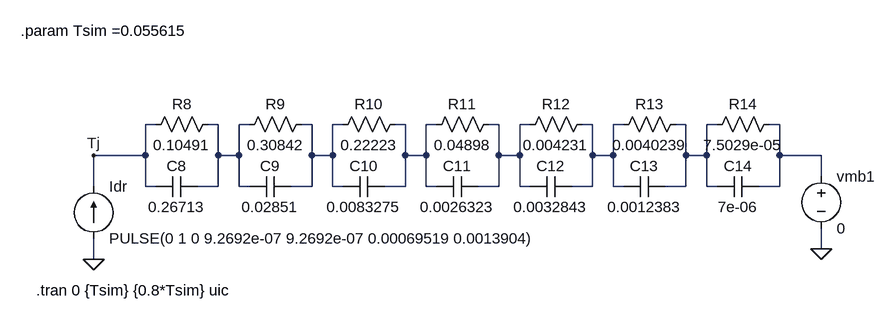
[diagram p0: schematic foster_test_matlab_pulsetrain.asc]
foster_test_matlab_pulsetrain.asc, the LTspice schematic file:
Version 4
SHEET 1 1444 1024
WIRE 0 320 -16 320
WIRE 96 320 80 320
WIRE 144 320 128 320
WIRE 240 320 224 320
WIRE 288 320 272 320
WIRE 384 320 368 320
WIRE 432 320 416 320
WIRE 528 320 512 320
WIRE 576 320 560 320
WIRE 672 320 656 320
WIRE 720 320 704 320
WIRE 816 320 800 320
WIRE 864 320 848 320
WIRE 960 320 944 320
WIRE -16 368 -16 320
WIRE -16 368 -96 368
WIRE 96 368 96 320
WIRE 128 368 128 320
WIRE 128 368 96 368
WIRE 240 368 240 320
WIRE 272 368 272 320
WIRE 272 368 240 368
WIRE 384 368 384 320
WIRE 416 368 416 320
WIRE 416 368 384 368
WIRE 528 368 528 320
WIRE 560 368 560 320
WIRE 560 368 528 368
WIRE 672 368 672 320
WIRE 704 368 704 320
WIRE 704 368 672 368
WIRE 816 368 816 320
WIRE 848 368 848 320
WIRE 848 368 816 368
WIRE 960 368 960 320
WIRE 1024 368 960 368
WIRE 1024 400 1024 368
WIRE -96 416 -96 368
WIRE -16 416 -16 368
WIRE 0 416 -16 416
WIRE 96 416 96 368
WIRE 96 416 64 416
WIRE 128 416 128 368
WIRE 144 416 128 416
WIRE 240 416 240 368
WIRE 240 416 208 416
WIRE 272 416 272 368
WIRE 288 416 272 416
WIRE 384 416 384 368
WIRE 384 416 352 416
WIRE 416 416 416 368
WIRE 432 416 416 416
WIRE 528 416 528 368
WIRE 528 416 496 416
WIRE 560 416 560 368
WIRE 576 416 560 416
WIRE 672 416 672 368
WIRE 672 416 640 416
WIRE 704 416 704 368
WIRE 720 416 704 416
WIRE 816 416 816 368
WIRE 816 416 784 416
WIRE 848 416 848 368
WIRE 864 416 848 416
WIRE 960 416 960 368
WIRE 960 416 928 416
WIRE 1024 512 1024 480
WIRE -96 528 -96 496
FLAG -96 368 Tj
FLAG -96 528 0
FLAG 1024 512 0
SYMBOL voltage 1024 384 R0
WINDOW 123 0 0 Left 0
WINDOW 39 0 0 Left 0
SYMATTR InstName vmb1
SYMATTR Value 0
SYMBOL res -16 336 R270
WINDOW 0 32 56 VTop 2
WINDOW 3 0 56 VBottom 2
SYMATTR InstName R8
SYMATTR Value 0.10491
SYMBOL res 128 336 R270
WINDOW 0 32 56 VTop 2
WINDOW 3 0 56 VBottom 2
SYMATTR InstName R9
SYMATTR Value 0.30842
SYMBOL res 272 336 R270
WINDOW 0 32 56 VTop 2
WINDOW 3 0 56 VBottom 2
SYMATTR InstName R10
SYMATTR Value 0.22223
SYMBOL res 416 336 R270
WINDOW 0 32 56 VTop 2
WINDOW 3 0 56 VBottom 2
SYMATTR InstName R11
SYMATTR Value 0.04898
SYMBOL res 560 336 R270
WINDOW 0 32 56 VTop 2
WINDOW 3 0 56 VBottom 2
SYMATTR InstName R12
SYMATTR Value 0.004231
SYMBOL res 704 336 R270
WINDOW 0 32 56 VTop 2
WINDOW 3 0 56 VBottom 2
SYMATTR InstName R13
SYMATTR Value 0.0040239
SYMBOL res 848 336 R270
WINDOW 0 32 56 VTop 2
WINDOW 3 0 56 VBottom 2
SYMATTR InstName R14
SYMATTR Value 7.5029e-05
SYMBOL cap 0 432 R270
WINDOW 0 32 32 VTop 2
WINDOW 3 0 32 VBottom 2
SYMATTR InstName C8
SYMATTR Value 0.26713
SYMBOL cap 144 432 R270
WINDOW 0 32 32 VTop 2
WINDOW 3 0 32 VBottom 2
SYMATTR InstName C9
SYMATTR Value 0.02851
SYMBOL cap 288 432 R270
WINDOW 0 32 32 VTop 2
WINDOW 3 0 32 VBottom 2
SYMATTR InstName C10
SYMATTR Value 0.0083275
SYMBOL cap 432 432 R270
WINDOW 0 32 32 VTop 2
WINDOW 3 0 32 VBottom 2
SYMATTR InstName C11
SYMATTR Value 0.0026323
SYMBOL cap 576 432 R270
WINDOW 0 32 32 VTop 2
WINDOW 3 0 32 VBottom 2
SYMATTR InstName C12
SYMATTR Value 0.0032843
SYMBOL cap 720 432 R270
WINDOW 0 32 32 VTop 2
WINDOW 3 0 32 VBottom 2
SYMATTR InstName C13
SYMATTR Value 0.0012383
SYMBOL cap 864 432 R270
WINDOW 0 32 32 VTop 2
WINDOW 3 0 32 VBottom 2
SYMATTR InstName C14
SYMATTR Value 7e-06
SYMBOL current -96 496 M180
WINDOW 0 24 80 Left 2
WINDOW 3 24 0 Left 2
WINDOW 123 0 0 Left 0
WINDOW 39 0 0 Left 0
SYMATTR InstName Idr
SYMATTR Value PULSE(0 1 0 9.2692e-07 9.2692e-07 0.00069519 0.0013904)
TEXT -208 176 Left 2 !.param Tsim =0.055615
TEXT -184 576 Left 2 !.tran 0 {Tsim} {0.8*Tsim} uic

The netlist it stands for:
* foster_test_matlab_pulsetrain.asc
vmb1 N007 0 0
R8 Tj N001 0.10491
R9 N001 N002 0.30842
R10 N002 N003 0.22223
R11 N003 N004 0.04898
R12 N004 N005 0.004231
R13 N005 N006 0.0040239
R14 N006 N007 7.5029e-05
C8 Tj N001 0.26713
C9 N001 N002 0.02851
C10 N002 N003 0.0083275
C11 N003 N004 0.0026323
C12 N004 N005 0.0032843
C13 N005 N006 0.0012383
C14 N006 N007 7e-06
Idr 0 Tj PULSE(0 1 0 9.2692e-07 9.2692e-07 0.00069519 0.0013904)
.param Tsim =0.055615
.tran 0 {Tsim} {0.8*Tsim} uic
.backanno
.end